# EAGLE design paddle1992 (EAGLE 4.16)
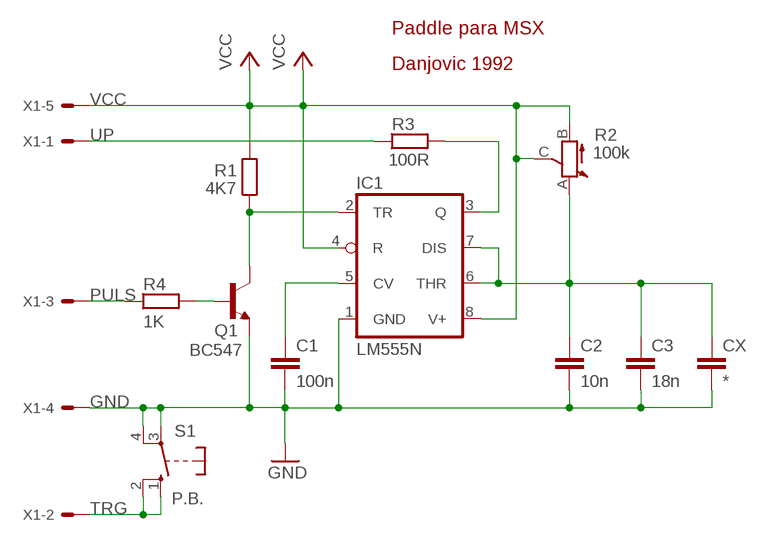
[diagram p0: schematic, sheet 1]

## Parts
C1  100n  C-EU050-030X075  [C050-030X075]
C2  10n  C-EU025_050-025X075  [C025_050-025X075]
C3  18n  C-EU025_050-025X075  [C025_050-025X075]
CX  *  C-EU025_050-025X075  [C025_050-025X075]
IC1  LM555N  [DIL08]
Q1  BC547  [TO92]
R1  4K7  R300  [R300]
R2  100k  POTENCIOMETRO-ATRAVES_PLACA  [POT-PLACA]
R3  100R  R300  [R300]
R4  1K  R300  [R300]
S1  P.B.  DTE6  [DTE6]
X1  22-23-2051  [22-23-2051]

## Nets
GND: C1.2 C2.2 C3.2 CX.2 IC1.1(GND) Q1.1(E) S1.3(P) S1.4(P) X1.4
N$1: IC1.2(TR) Q1.3(C) R1.P$1
N$2: Q1.2(B) R4.P$2
N$3: C1.1 IC1.5(CV)
N$6: C2.1 C3.1 CX.1 IC1.6(THR) IC1.7(DIS) R2.A
N$9: IC1.3(Q) R3.P$2
PULS: R4.P$1 X1.3
TRG: S1.1(S) S1.2(S) X1.2
UP: R3.P$1 X1.1
VCC: IC1.4(R) IC1.8(V+) R1.P$2 R2.B R2.C X1.5

## Notes on the sheet
- Paddle para MSX
- Danjovic 1992

## Library data of the parts
C1-C3 CX = rcl:C-EU: CAPACITOR, European symbol
IC1 = linear:*555: TIMER
Q1 = transistor-npn:BC547*: NPN Transistor
R1 R3 R4 = diversos2:R*: Resistor
R2 = diversos2:POTENCIOMETRO*: Potenciometro
S1 = switch-misc:DT: ITT SWITCH
X1 = con-molex:22-23-2051: .100" (2.54mm) Center Header - 5 Pin

## Board
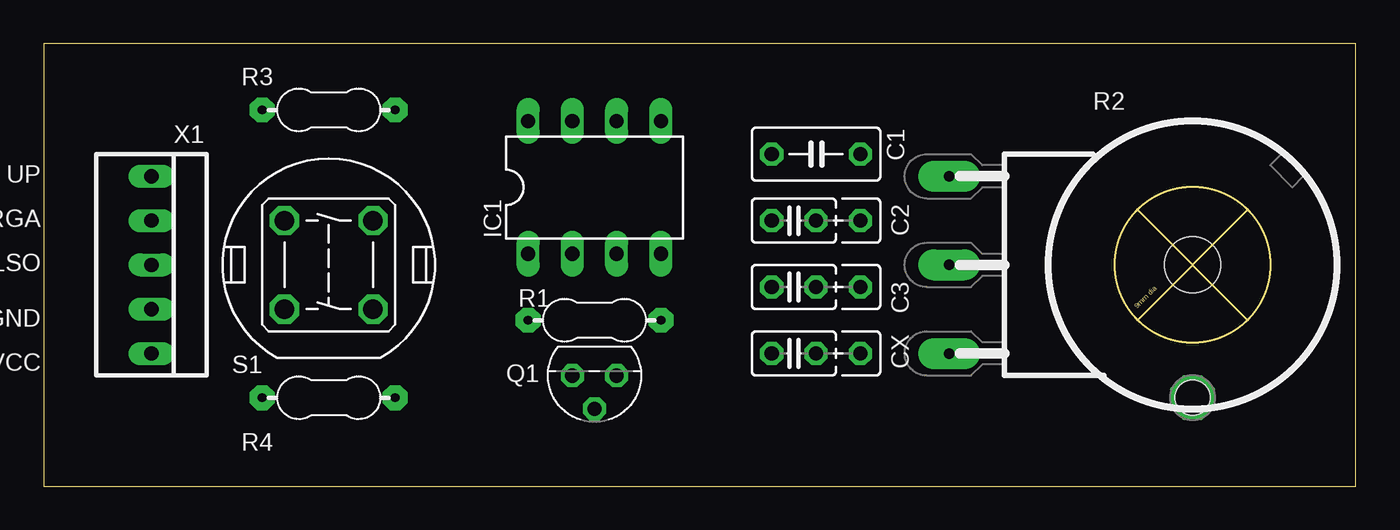
[diagram p1: board, top side]
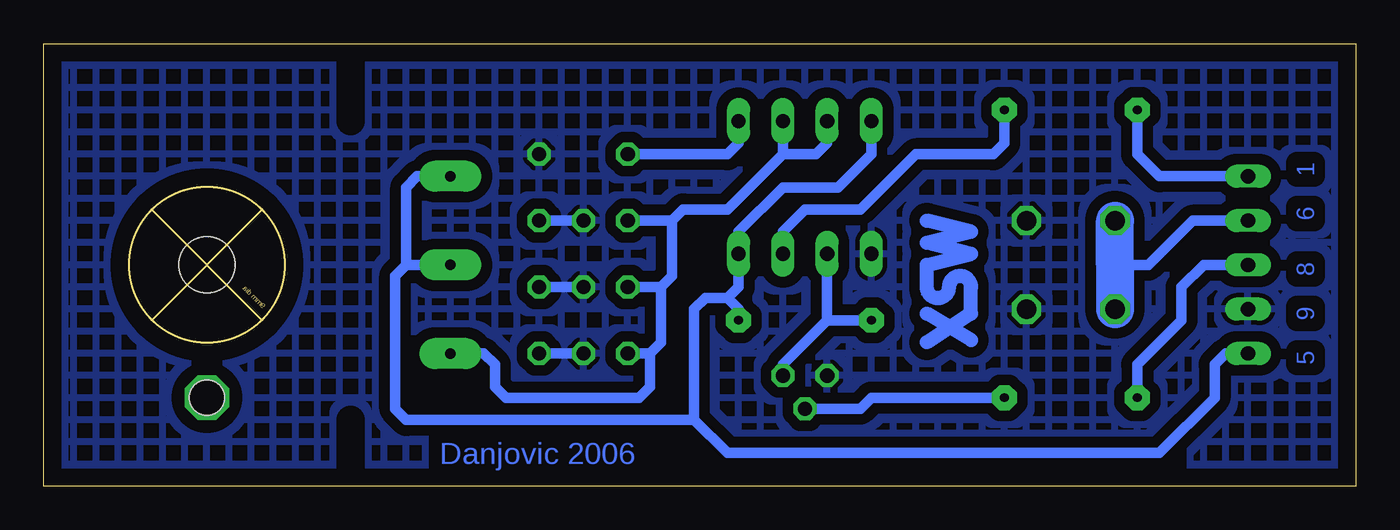
[diagram p2: board, bottom side, seen from below]

Size 75.23 x 25.39 mm. Coordinates in mm from the lower left corner, seen from the top.
Outline: 0,0 75.23,0 75.23,25.39 0,25.39 0,0
Copper layers (1*16): Top 0.035mm / dielectric 1.5mm / Bottom 0.035mm
Design rules "default": minimum track width 10mil, minimum drill 24mil, track to track 8mil, track to pad 8mil, pad to pad 8mil, via to via 8mil, smd to smd 8mil, copper to edge 40mil, drill to drill 8mil, minimum pad ring 10mil, minimum via ring 8mil, stop-mask expansion 4mil, vias tented up to drill 0mil, thermal gap 10mil
bRestrict: 3 lines

### Footprints (pad centres in the part's own frame; a part is rotated, then mirrored left to right if it is on the bottom)
C050-030X075 = drill 0.813 octagon: 1 -2.54,0; 2 2.54,0
C025_050-025X075 = drill 0.813 octagon: 1 -1.27,0; 2 1.27,0; 3 3.81,0
DIL08 = drill 0.813 long: 1 -3.81,-3.81; 2 -1.27,-3.81; 3 1.27,-3.81; 4 3.81,-3.81; 5 3.81,3.81; 6 1.27,3.81; 7 -1.27,3.81; 8 -3.81,3.81
TO92 = drill 0.813 octagon: 1 1.27,0; 2 0,1.905; 3 -1.27,0
R300 = drill 0.5 pad 1.422 octagon: P$1 3.81,0; P$2 -3.81,0
POT-PLACA = drill 0.6 pad 1.778 long: A -13.97,-5.08; B -13.97,5.08; C -13.97,0 | hole 3.2: 0,0 | hole 2: 0,-7.62
DTE6 = drill 1.118 octagon: 1 -2.54,2.54; 2 2.54,2.54; 3 2.54,-2.54; 4 -2.54,-2.54
22-23-2051 = drill 0.813 long: 1 -5.08,0; 2 -2.54,0; 3 0,0; 4 2.54,0; 5 5.08,0

### Placement (x,y rotation side)
C1  44.29,19.05 0 top
C2  43.02,15.23 0 top
C3  43.02,7.62 0 top
CX  43.02,11.43 0 top
IC1  31.59,17.14 0 top
Q1  31.59,6.34 180 top
R1  31.59,9.52 180 top
R2  65.88,12.7 0 top
R3  16.35,21.59 180 top
R4  16.35,5.08 180 top
S1  16.35,12.7 90 top
X1  6.18,12.7 270 top

### Tracks (layer width: path | path; a pad name or v marks a point on that pad's centre or on a via)
GND
  Bottom 0.61: C2.2 46.83,15.23 | CX.2 46.83,11.43 | C3.2 46.83,7.62
  pour Bottom (isolate 0.61, hatched): -1.44,26.67 -1.44,0 76.67,0 76.67,26.67
N$1
  Bottom 0.61: 30.32,9.52 IC1.2 | R1.P$1 30.32,9.52 | Q1.3 32.86,6.98 30.32,9.52
N$2
  Bottom 0.61: Q1.2 28.41,4.44 27.78,5.08 R4.P$2
N$3
  Bottom 0.61: IC1.5 35.4,19.68 36.03,19.05 C1.1
N$4  (via drill 0.5 pad 2.54)
  other vias: 65.88,12.7
N$5  (via drill 0.5 pad 2.54)
  other vias: 65.88,5.08
N$6
  Bottom 0.61: IC1.7 30.32,19.68 30.95,19.05 32.86,19.05 | 32.86,19.05 IC1.6 | 32.86,19.05 36.03,15.87 38.57,15.87 39.2,15.23 | 39.2,15.23 C2.1 | 39.84,11.43 CX.1 | 39.84,11.43 39.2,12.06 39.2,15.23 | 40.48,7.62 C3.1 | 40.48,7.62 39.84,8.25 39.84,11.43 | R2.A 50,7.62 49.37,6.98 49.37,5.71 48.73,5.08 41.11,5.08 40.48,5.71 40.48,7.62
N$7
  Bottom 0.813: 22.06,8.38 24.6,9.9
N$8
  Bottom 0.813: 24.6,15.23 22.06,14.6 24.6,13.97 22.06,13.33 24.6,12.7 24.6,11.43 arc-180 23.33,11.43 arc180 22.06,11.43 22.06,9.9 24.6,8.25
N$9
  Bottom 0.61: R3.P$2 20.16,19.68 20.79,19.05 25.23,19.05 28.41,15.87 31.59,15.87 32.86,14.6 IC1.3
PULS
  Bottom 0.61: X1.3 8.73,12.7 10,11.43 10,9.52 12.54,6.98 R4.P$1
TRG
  Bottom 0.61: X1.2 9.36,15.23 11.9,12.7 13.81,12.7
  Bottom 2.184: S1.1 13.81,12.7 S1.2
UP
  Bottom 0.61: X1.1 11.27,17.77 12.54,19.05 R3.P$1
VCC
  Bottom 0.61: IC1.8 27.78,19.05 29.68,17.14 32.86,17.14 35.4,14.6 IC1.4 35.4,11.43 36.03,10.79 | R1.P$2 35.4,10.16 36.03,10.79 | R2.B 53.81,17.77 54.45,17.14 54.45,12.7 | 54.45,12.7 55.08,12.06 55.08,4.44 54.45,3.8 37.94,3.8 | 54.45,12.7 R2.C | 37.94,3.8 37.94,10.16 37.3,10.79 36.03,10.79 | X1.5 7.46,7.62 8.09,6.98 8.09,5.08 11.27,1.9 36.03,1.9 37.94,3.8

### Text on the board
Bottom: 1 | 6 | 8 | 9 | 5 | Danjovic 2006
tPlace: UP | TRGA | PULSO | GND | VCC